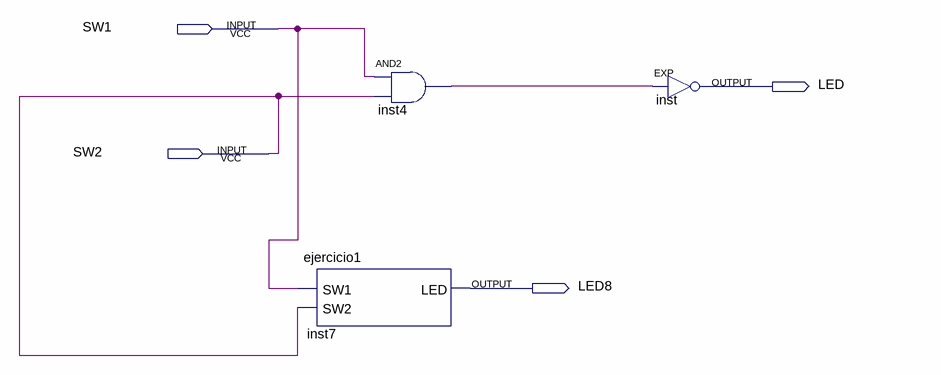
[diagram p0: schematic sheet]
// Quartus schematic ejercicio1_diagram_block.bdf as structural Verilog: 3 symbols, 4 pins
module ejercicio1_diagram_block (
  input  SW1,
  input  SW2,
  output LED,
  output LED8
);

  wire inst4_out;

  ejercicio1 inst7 (.SW1(SW1), .SW2(SW2), .LED(LED8));
  and inst4 (inst4_out, SW1, SW2);
  EXP inst (.IN(inst4_out), .OUT(LED));
endmodule
